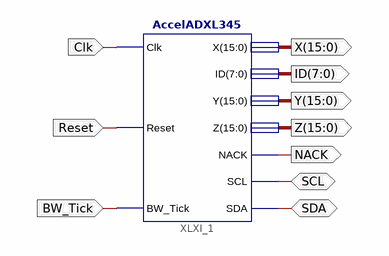
[diagram p0: schematic sheet 1]
// Xilinx ISE schematic ACL.sch (xc9500xl) as structural Verilog: 1 symbols, 10 ports
module ACL (
  input  Clk,
  input  Reset,
  input  BW_Tick,
  inout  SDA,
  inout  SCL,
  output NACK,
  output [15:0] Z,
  output [15:0] Y,
  output [7:0] ID,
  output [15:0] X
);

  AccelADXL345 XLXI_1 (
    .Clk(Clk), .Reset(Reset), .BW_Tick(BW_Tick), .X(X), .ID(ID), .Y(Y), .Z(Z), .NACK(NACK), .SCL(SCL),
    .SDA(SDA));
endmodule
